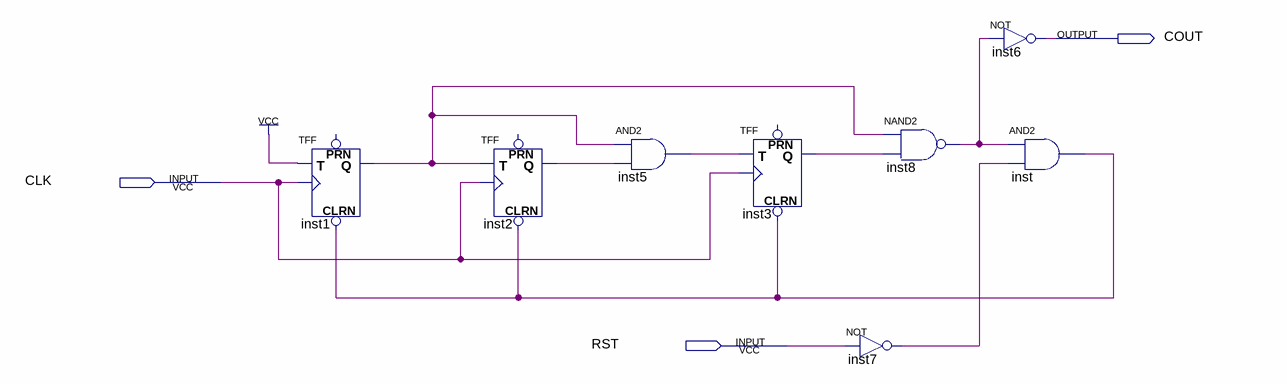
[diagram p0: schematic sheet]
// Quartus schematic counter_mod5.bdf as structural Verilog: 8 symbols, 3 pins
module counter_mod5 (
  input  CLK,
  input  RST,
  output COUT
);

  wire inst1_q, inst2_q, inst3_q, inst5_out, inst7_out, inst8_out, inst_out;

  TFF inst1 (.CLRN(inst_out), .T(1'b1), .CLK(CLK), .Q(inst1_q));  // open: PRN
  TFF inst2 (.CLRN(inst_out), .T(inst1_q), .CLK(CLK), .Q(inst2_q));  // open: PRN
  and inst5 (inst5_out, inst1_q, inst2_q);
  TFF inst3 (.CLRN(inst_out), .T(inst5_out), .CLK(CLK), .Q(inst3_q));  // open: PRN
  nand inst8 (inst8_out, inst1_q, inst3_q);
  not inst7 (inst7_out, RST);
  not inst6 (COUT, inst8_out);
  and inst (inst_out, inst8_out, inst7_out);
endmodule
